# EAGLE design board (EAGLE 8.2.0)
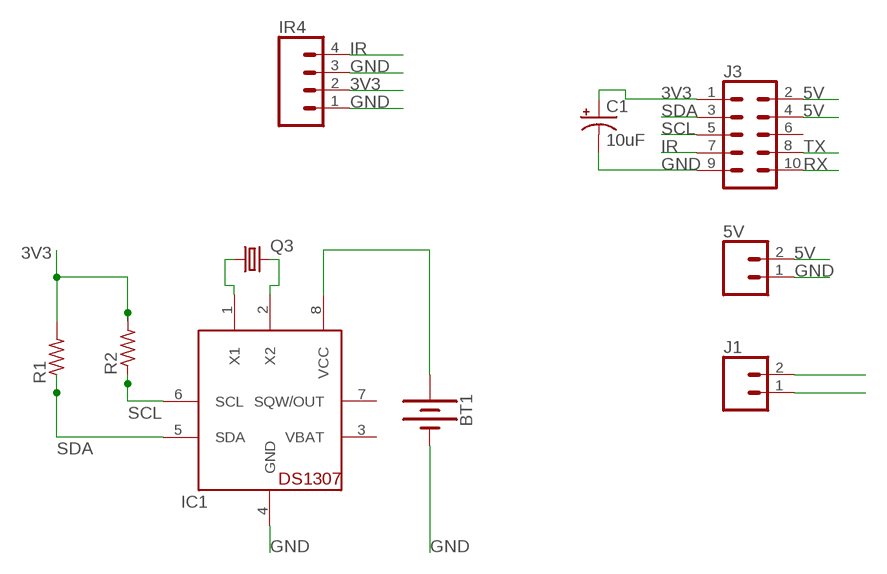
[diagram p0: schematic, sheet 1]

## Parts
5V  CONN_02POLAR  [MOLEX-1X2]
BT1  BATTERY-20MM_PTH  [BATTCOM_20MM_PTH]
C1  10uF  10UF-POLAR-RADIAL-2.5MM-25V-20%  [CPOL-RADIAL-2.5MM-5MM]
IC1  DS1307  [DIL08]
IR4  CONN_04POLAR  [MOLEX-1X4]
J1  CONN_02  [1X02]
J3  CONN_05X2SHD_LOCK  [2X5-SHROUDED_LOCK]
Q3  CRYSTALTC38H  [TC38H]
R1  R-US_0204/7  [0204/7]
R2  R-US_0204/7  [0204/7]

## Nets
3V3: C1.1(+) IR4.2 J3.1 R1.2 R2.2
5V: 5V.2 J3.2 J3.4
GND: 5V.1 BT1.2(-) C1.2(-) IC1.4(GND) IR4.1 IR4.3 J3.9
IR: IR4.4 J3.7
N$1: IC1.1(X1) Q3.1
N$2: IC1.2(X2) Q3.2
N$3: BT1.1(+) IC1.8(VCC)
RX: J1.1 J3.10
SCL: IC1.6(SCL) J3.5 R2.1
SDA: IC1.5(SDA) J3.3 R1.1
TX: J1.2 J3.8
Unconnected: IC1.7(SQW/OUT) J3.6

## Power pins joined to a net without a drawn wire
VBAT: IC1.3(VBAT)

## Library data of the parts
5V = SparkFun-Connectors:CONN_02: Multi connection point. Often used as Generic Header-pin footprint for 0.1 inch spaced/style header connections On any of the 0.1 inch spaced packages, you can populate with these: Break Away Headers - Straight <https://www.sparkfun.com/products/116> (PRT-00116) Break Away Male Headers - Right Angle <https://www.sparkfun.com/products/553> (PRT-00553) Female Headers <https://www.sparkfun.com/products/115> (PRT-00115) Break Away Headers - Machine Pin <https://www.sparkfun.com/products/117> (PRT-00117) Break Away Female Headers - Swiss Machine Pin <https://www.sparkfun.com/products/743> (PRT-00743) For SCREWTERMINALS and SPRING TERMINALS visit here: Screw Terimnals on SparkFun.com <https://www.sparkfun.com/search/results?term=Screw+Terminals> (5mm/3.5mm/2.54mm spacing) This device is also useful as a general connection point to wire up your design to another part of your project. Our various solder wires solder well into these plated through hole pads. Hook-Up Wire - Assortment (Stranded, 22 AWG) <https://www.sparkfun.com/products/11375> (PRT-11375) Hook-Up Wire - Assortment (Solid Core, 22 AWG) <https://www.sparkfun.com/products/11367> (PRT-11367) View the entire wire category on our website here <https://www.sparkfun.com/categories/141> Special notes: Molex polarized connector foot print use with: PRT-08233 with associated crimp pins and housings. 2.54_SCREWTERM for use with PRT-10571. 3.5mm Screw Terminal footprints for PRT-08084 5mm Screw Terminal footprints for use with PRT-08432; SF_ID: PRT-09918
BT1 = SparkFun-Batteries:BATTERY: Battery - Single Cell A variety of battery chemistries, sizes, and footprints. Device List: 20MM_PTH - Coin Cell Battery Holder - 20mm (PTH) <https://www.sparkfun.com/products/783> 6.8MM_PTH - Coin Cell Battery Holder - 6.8MM(SMD) <https://www.digikey.com/product-detail/en/seiko-instruments/MS621FE-FL11E/728-1057-ND/1889208?WT.srch=1&gclid=CNOQ5a6LzdQCFZS2wAodXCkE0g> 12MM_SMD - Coin Cell Battery Holder - 12mm (SMD) <https://www.sparkfun.com/products/10592> 12MM_PTH - Coin Cell Battery Holder - 12mm (PTH) <https://www.sparkfun.com/products/7948> 20MM_SMD - 20mm Coin Cell Battery Holder (SMD) (2 legs) Used on the Big Time Watch Kit <https://www.sparkfun.com/products/11734> 20MM_SMD_4LEGS - Coin Cell Battery Holder - 20mm (SMD) <https://www.sparkfun.com/products/11892> 20MM_SMD_4LEGS_OVERPASTE - Coin Cell Battery Holder - 20mm (SMD) <https://www.sparkfun.com/products/11892> (Over-paste on the legs) 24.5MM_PTH - Coin Cell Battery Holder - 24.5mm (PTH) <https://www.sparkfun.com/products/8863> 9V - 9V Battery Holder - PC Mount Used on the SparkFun SparkPunk Sound Kit <https://www.sparkfun.com/products/11177> and SparkFun SparkPunk Sequencer Kit <https://www.sparkfun.com/products/12707> 18650 - Battery Holder - 18650 (PTH) <https://www.sparkfun.com/products/13113> AA - Battery Holder - 1xAA (PTH) <https://www.sparkfun.com/products/7949> AAA - Battery Holder - 1xAAA (PTH) <https://www.sparkfun.com/products/12718> AA_KIT - Battery Holder - 1xAA (PTH) <https://www.sparkfun.com/products/7949> Special kit package - pads only have exposed copper on one side of the board. AAA_KIT - Battery Holder - 1xAAA (PTH) <https://www.sparkfun.com/products/12718> Special kit package - pads only have exposed copper on one side of the board.; PROD_ID: BATT-09031; SF_SKU: PRT-00783
C1 = SparkFun-Capacitors:10UF-POLAR: 10.0µF polarized capacitors A capacitor is a passive two-terminal electrical component used to store electrical energy temporarily in an electric field.; PROD_ID: CAP-08440
IC1 = adafruit:DS1307: DS1307 Real time clock (RTC) with battery backup ability. Talk to it via i2c
IR4 = SparkFun-Connectors:CONN_04: Multi connection point. Often used as Generic Header-pin footprint for 0.1 inch spaced/style header connections On any of the 0.1 inch spaced packages, you can populate with these: Break Away Headers - Straight <https://www.sparkfun.com/products/116> (PRT-00116) Break Away Male Headers - Right Angle <https://www.sparkfun.com/products/553> (PRT-00553) Female Headers <https://www.sparkfun.com/products/115> (PRT-00115) Break Away Headers - Machine Pin <https://www.sparkfun.com/products/117> (PRT-00117) Break Away Female Headers - Swiss Machine Pin <https://www.sparkfun.com/products/743> (PRT-00743) For SCREWTERMINALS and SPRING TERMINALS visit here: Screw Terimnals on SparkFun.com <https://www.sparkfun.com/search/results?term=Screw+Terminals> (5mm/3.5mm/2.54mm spacing) This device is also useful as a general connection point to wire up your design to another part of your project. Our various solder wires solder well into these plated through hole pads. Hook-Up Wire - Assortment (Stranded, 22 AWG) <https://www.sparkfun.com/products/11375> (PRT-11375) Hook-Up Wire - Assortment (Solid Core, 22 AWG) <https://www.sparkfun.com/products/11367> (PRT-11367) View the entire wire category on our website here <https://www.sparkfun.com/categories/141> Special notes: Molex polarized connector foot print use with SKU : PRT-08231 with associated crimp pins and housings. 1MM SMD Version SKU: PRT-10208; PROD_ID: CONN-08186; SF_ID: PRT-08231
J1 = SparkFun-Connectors:CONN_02: Multi connection point. Often used as Generic Header-pin footprint for 0.1 inch spaced/style header connections On any of the 0.1 inch spaced packages, you can populate with these: Break Away Headers - Straight <https://www.sparkfun.com/products/116> (PRT-00116) Break Away Male Headers - Right Angle <https://www.sparkfun.com/products/553> (PRT-00553) Female Headers <https://www.sparkfun.com/products/115> (PRT-00115) Break Away Headers - Machine Pin <https://www.sparkfun.com/products/117> (PRT-00117) Break Away Female Headers - Swiss Machine Pin <https://www.sparkfun.com/products/743> (PRT-00743) For SCREWTERMINALS and SPRING TERMINALS visit here: Screw Terimnals on SparkFun.com <https://www.sparkfun.com/search/results?term=Screw+Terminals> (5mm/3.5mm/2.54mm spacing) This device is also useful as a general connection point to wire up your design to another part of your project. Our various solder wires solder well into these plated through hole pads. Hook-Up Wire - Assortment (Stranded, 22 AWG) <https://www.sparkfun.com/products/11375> (PRT-11375) Hook-Up Wire - Assortment (Solid Core, 22 AWG) <https://www.sparkfun.com/products/11367> (PRT-11367) View the entire wire category on our website here <https://www.sparkfun.com/categories/141> Special notes: Molex polarized connector foot print use with: PRT-08233 with associated crimp pins and housings. 2.54_SCREWTERM for use with PRT-10571. 3.5mm Screw Terminal footprints for PRT-08084 5mm Screw Terminal footprints for use with PRT-08432
J3 = SparkFun-Connectors:CONN_05X2: Multi connection point. Often used as Generic Header-pin footprint for 0.1 inch spaced/style header connections For AVR SPI programming port, see special device with nice symbol: "AVR_SPI_PROG_5x2.dev" You can populate with any combo of single row headers, but if you'd like an exact match, check these: 2x5 AVR ICSP Male Header <https://www.sparkfun.com/products/778> (PRT-00778) 2x5 Pin Shrouded Header <https://www.sparkfun.com/products/8506> (PRT-08506) On any of the 0.1 inch spaced packages, you can populate with these: Break Away Headers - Straight <https://www.sparkfun.com/products/116> (PRT-00116) Break Away Male Headers - Right Angle <https://www.sparkfun.com/products/553> (PRT-00553) Female Headers <https://www.sparkfun.com/products/115> (PRT-00115) Break Away Headers - Machine Pin <https://www.sparkfun.com/products/117> (PRT-00117) Break Away Female Headers - Swiss Machine Pin <https://www.sparkfun.com/products/743> (PRT-00743) Special note: the shrouded connector mates well with our 5x2 ribbon cables: 2x5 Pin IDC Ribbon Cable <https://www.sparkfun.com/products/8535> (PRT-08535); PROD_ID: CONN-08671; SF_ID: PRT-08506
Q3 = adafruit:CRYSTAL: CRYSTAL; OC_FARNELL: unknown; OC_NEWARK: unknown
R1 R2 = adafruit:R-US_: RESISTOR, American symbol

## Board
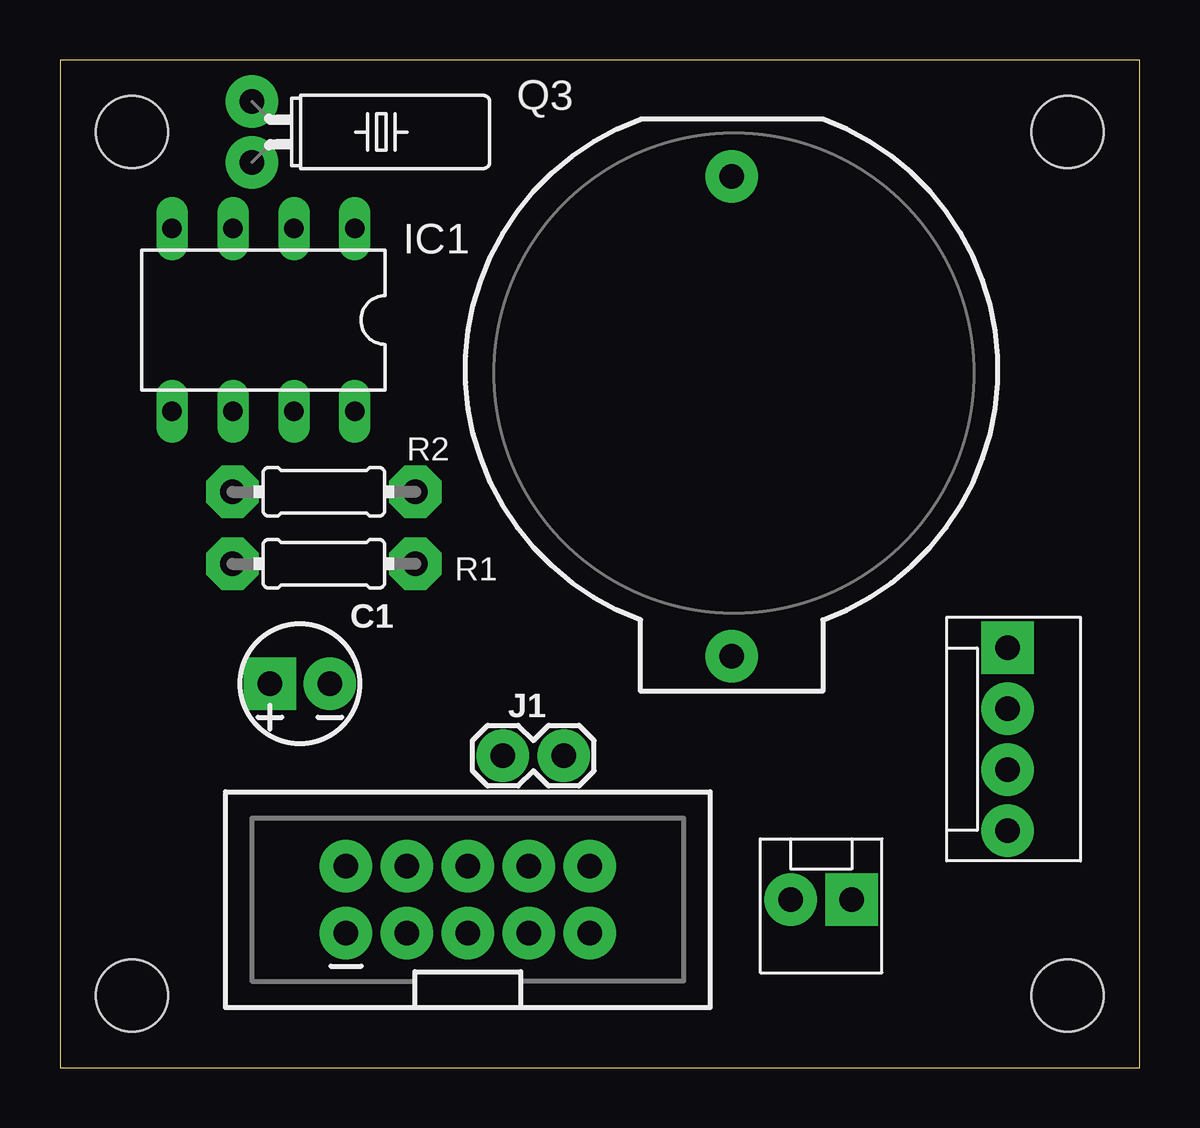
[diagram p1: board, top side]
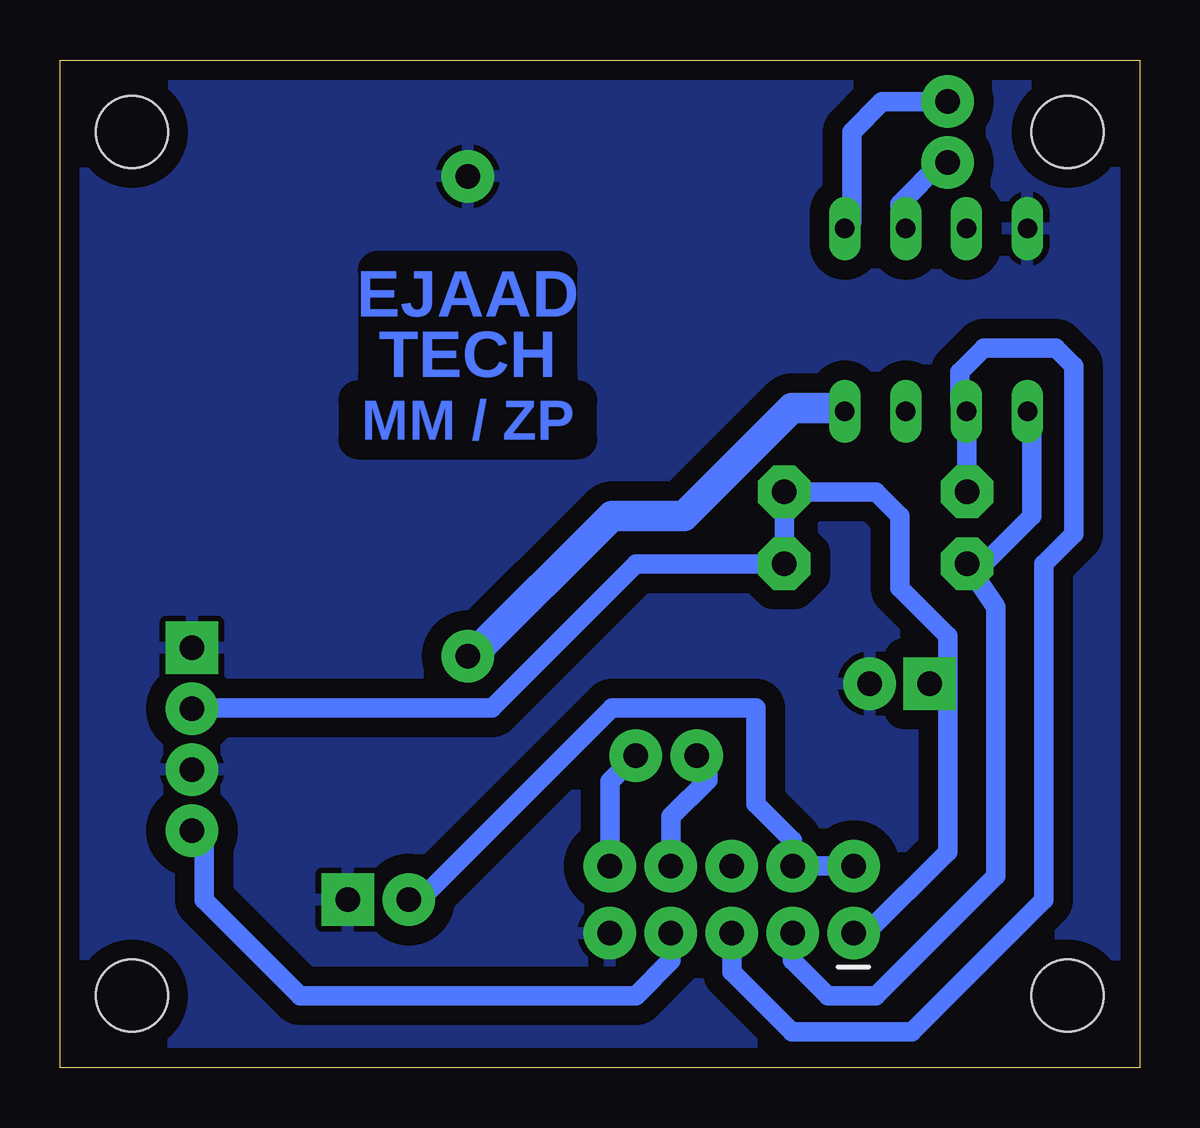
[diagram p2: board, bottom side, seen from below]

Size 45 x 42 mm. Coordinates in mm from the lower left corner, seen from the top.
Outline: 0,0 45,0 45,42 0,42 0,0
Copper layers (1*16): Top 0.035mm / dielectric 1.5mm / Bottom 0.035mm
Design rules "SeeedStudio_2layer_DRU_no_angle_20140221": minimum track width 6mil, minimum drill 12mil, track to track 6mil, track to pad 6mil, pad to pad 6mil, via to via 6mil, smd to smd 0mil, copper to edge 10mil, drill to drill 10mil, minimum pad ring 10mil, minimum via ring 6mil, stop-mask expansion 2mil, vias tented up to drill 100mil, thermal gap 10mil
Holes 3 mm at 3,3 42,3 42,39 3,39

### Footprints (pad centres in the part's own frame; a part is rotated, then mirrored left to right if it is on the bottom)
MOLEX-1X2 = drill 1.016 pad 2.184 square: 1 0,0 | drill 1.016 pad 2.184: 2 2.54,0
BATTCOM_20MM_PTH = drill 1.016 pad 2.184: 1 11.85,0; 2 -8.15,0
CPOL-RADIAL-2.5MM-5MM = drill 1.016 pad 2.184 square: 1 1.25,0 | drill 1.016 pad 2.184: 2 -1.25,0
DIL08 = drill 0.813 long: 1 -3.81,-3.81; 2 -1.27,-3.81; 3 1.27,-3.81; 4 3.81,-3.81; 5 3.81,3.81; 6 1.27,3.81; 7 -1.27,3.81; 8 -3.81,3.81
MOLEX-1X4 = drill 1.016 pad 2.184 square: 1 0,0 | drill 1.016 pad 2.184: 2 2.54,0; 3 5.08,0; 4 7.62,0
1X02 = drill 1.016 pad 2.184: 1 0,0; 2 2.54,0
2X5-SHROUDED_LOCK = drill 1.016 pad 2.184: 1 -1.397,5.08; 2 1.397,5.08; 3 -1.397,2.54; 4 1.397,2.54; 5 -1.397,0; 6 1.397,0; 7 -1.397,-2.54; 8 1.397,-2.54; 9 -1.397,-5.08; 10 1.397,-5.08
TC38H = drill 1.016 pad 2.184: 1 -1.27,0; 2 1.27,0
0204/7 = drill 1.016 pad 2.184 octagon: 1 -3.81,0; 2 3.81,0

### Placement (x,y rotation side)
5V  33,7 180 top
BT1  28,29 270 top
C1  10,16 180 top
IC1  8.48,31.16 180 top
IR4  39.5,17.5 270 top
J1  21,13 180 top
J3  17,7 90 top
Q3  8,39 270 top
R1  11,21 0 top
R2  11,24 0 top

### Tracks (layer width: path | path; a pad name or v marks a point on that pad's centre or on a via)
3V3
  Bottom 0.813: J3.1 11.4,5.6 8,9 8,15.75 | IR4.2 38.46,15 27,15 21,21 R1.2 R2.2 11,24 10,23 10,20 8,18 8,15.75 | 8.5,15.75 C1.1 8.25,16 8,15.75
5V
  Bottom 0.813: J3.2 J3.4 | J3.4 14.6,8.4 | 5V.2 30,7 22,15 16,15 16,11 14.46,9.46 J3.4
GND
  pour Bottom (isolate 0.813): 0,44 46,44 48,42 48,-1 46,-3 -1,-3 -4,0 -4,40
IR
  Bottom 0.813: J3.7 19.54,4.46 21,3 35,3 39,7 39,9.38 IR4.4
N$1
  Bottom 0.813: Q3.1 10.73,40.27 12,39 12,35.26 IC1.1
N$2
  Bottom 0.813: Q3.2 8.27,37.73 10,36 10,35.22 IC1.2
N$3
  Bottom 1.27: BT1.1 27.85,17.15 22,23 19,23 14.5,27.5 12.44,27.5 IC1.8
N$4  (via drill 0.4 pad 0.85)
  other vias: 3,3
N$5  (via drill 0.4 pad 0.85)
  other vias: 42,3
N$6  (via drill 0.4 pad 0.85)
  other vias: 42,39
N$7  (via drill 0.4 pad 0.85)
  other vias: 3,39
RX
  Bottom 0.813: J3.10 22.08,11.92 J1.1
SCL
  Bottom 0.813: J3.5 17,4 14.5,1.5 9.5,1.5 4,7 4,21 2.75,22.25 2.75,29.25 3.5,30 6.5,30 7.5,29 7.5,27.64 IC1.6 7.19,27.33 R2.1
SDA
  Bottom 0.813: J3.3 14.46,4.46 13,3 11,3 6,8 6,19.19 R1.1 6.5,21 4.5,23 4.5,27.18 IC1.5
TX
  Bottom 0.813: J3.8 19.54,10.46 18,12 18,12.54 J1.2

### Text on the board
Bottom: EJAAD / TECH | MM / ZP
silktop: CR2032 | EJAAD / TECH | IR SENSOR + / RTC CLOCK | ZP, NJ, MM, / WU, NP, AR / AV, SI, AA. | 1 2 3 | FESF / EJAADTECH | Remote / Sensor | + | - | Fan | IDC-PI